# EAGLE design 1U_LFO (EAGLE 8.1.1)
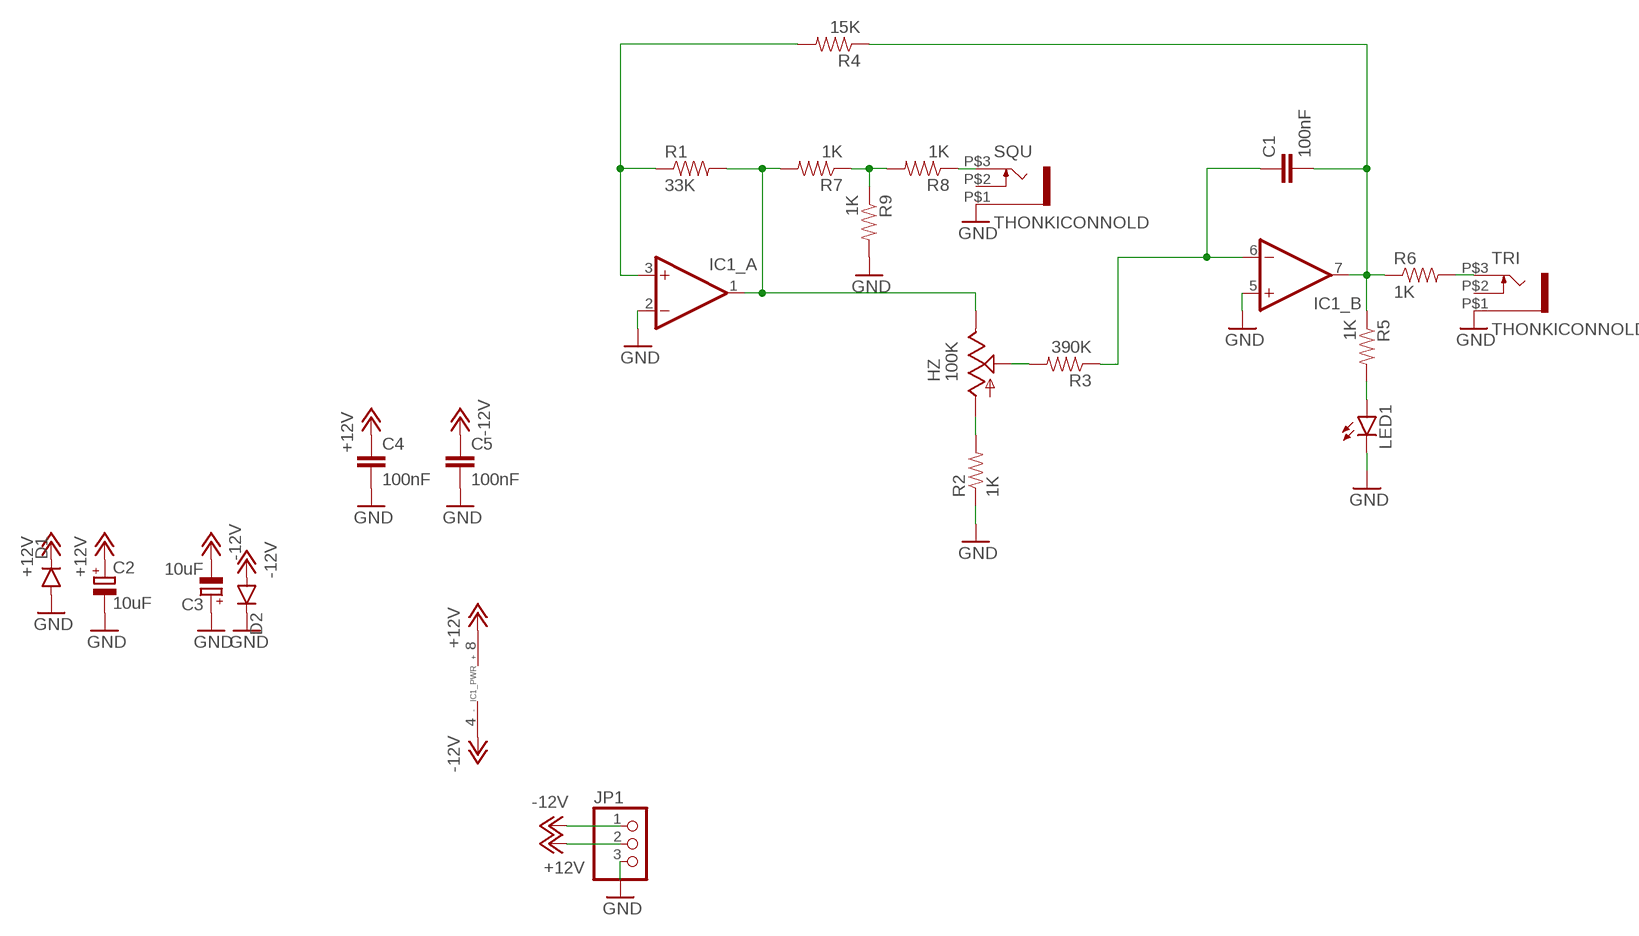
[diagram p0: schematic, sheet 1]

## Parts
C1  100nF  CAP0603-CAP  [0603-CAP]
C2  10uF  CAPACITOR_POL-CASE_B  [CASE_B]
C3  10uF  CAPACITOR_POL-CASE_B  [CASE_B]
C4  100nF  CAP0603-CAP  [0603-CAP]
C5  100nF  CAP0603-CAP  [0603-CAP]
D1  DIODESOD123  [SOD-123]
D2  DIODESOD123  [SOD-123]
HZ  100K  9MM_SNAP-IN_POT_  [9MM_SNAP-IN_POT]
IC1  DUALSMD  [SO08]
JP1  EUROPWR_TILE-TILE  [1X03_EUROPWR_TILE]
LED1  LED3MM  [LED3MM]
R1  33K  RESISTOR0603-RES  [0603-RES]
R2  1K  RESISTOR0603-RES  [0603-RES]
R3  390K  RESISTOR0603-RES  [0603-RES]
R4  15K  RESISTOR0603-RES  [0603-RES]
R5  1K  RESISTOR0603-RES  [0603-RES]
R6  1K  RESISTOR0603-RES  [0603-RES]
R7  1K  RESISTOR0603-RES  [0603-RES]
R8  1K  RESISTOR0603-RES  [0603-RES]
R9  1K  RESISTOR0603-RES  [0603-RES]
SQU  THONKICONNOLD  [THONKICONN]
TRI  THONKICONNOLD  [THONKICONN]

## Nets
+12V: C2.+ C4.1 D1.C IC1.8(_PWR:V+) JP1.2
-12V: C3.- C5.1 D2.A IC1.4(_PWR:V-) JP1.1
GND: C2.- C3.+ C4.2 C5.2 D1.A D2.C IC1.2(_A:-IN) IC1.5(_B:+IN) JP1.3 LED1.K(C) R2.1 R9.2 SQU.P$1 TRI.P$1
N$1: HZ.3(E) IC1.1(_A:OUT) R1.2 R7.2
N$2: HZ.1(A) R2.2
N$3: HZ.2(S) R3.2
N$4: C1.1 IC1.6(_B:-IN) R3.1
N$5: IC1.3(_A:+IN) R1.1 R4.2
N$6: C1.2 IC1.7(_B:OUT) R4.1 R5.1 R6.1
N$7: LED1.A R5.2
N$8: R6.2 TRI.P$3
N$9: R8.1 SQU.P$3
N$10: R7.1 R8.2 R9.1
Unconnected: SQU.P$2 TRI.P$2

## Library data of the parts
C1 C4 C5 = SparkFun-Passives:CAP: Capacitor Standard 0603 ceramic capacitor, and 0.1" leaded capacitor.
C2 C3 = dp_devices:CAPACITOR_POL: Polarized capacitor in various packages
D1 D2 = SparkFun-DiscreteSemi:DIODE: Diode These are standard reverse protection diodes and small signal diodes. SMA package can handle up to about 1A. SOD-323 can handle about 200mA. What the SOD-323 package when ordering, there are some mfgs out there that are 5-pin packages.
HZ = MusicThingModular:9MM_SNAP-IN_POT: 9mm vertical snap-in pot, Alpha / Panasonic style
IC1 = integrated circuits:DUAL: OP AMP
JP1 = tsyklon-labs:EUROPWR_TILE: PIN HEADER
LED1 = SparkFun-LED:LED: LEDs Standard schematic elements and footprints for 5mm, 3mm, 1206, and 0603 sized LEDs. 5mm - Spark Fun Electronics SKU : COM-00529 (and others)
R1-R9 = SparkFun-Passives:RESISTOR: Resistor Basic schematic elements and footprints for 0603, 1206, and PTH resistors.
SQU TRI = MusicThingModular:THONKICONN: 3.5mm socket for Eurorack modular synths

## Board
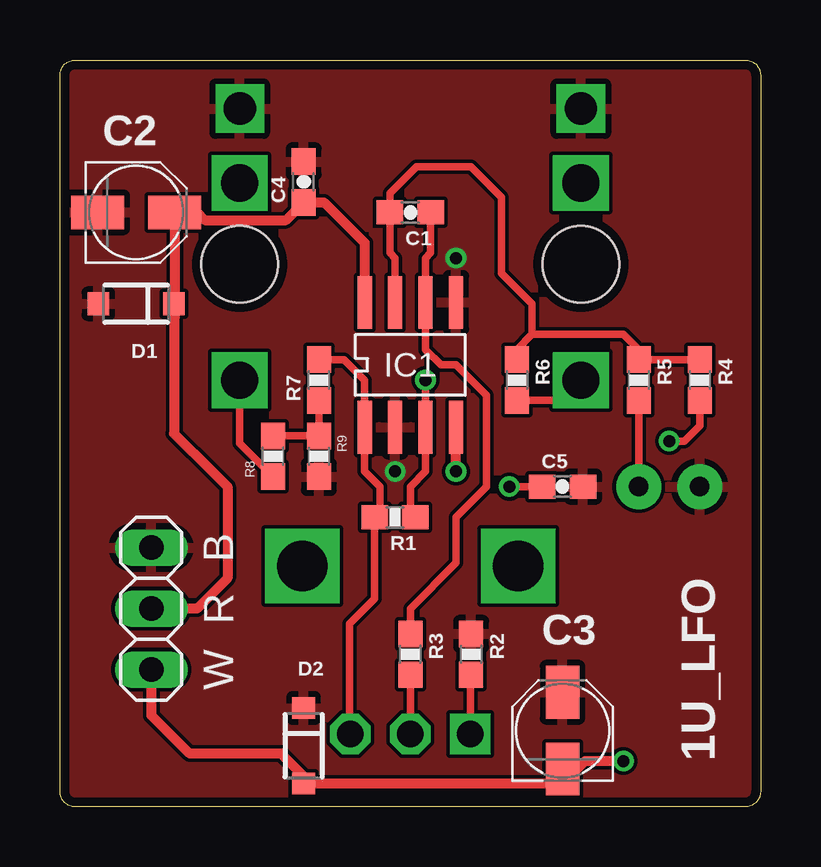
[diagram p1: board, top side]
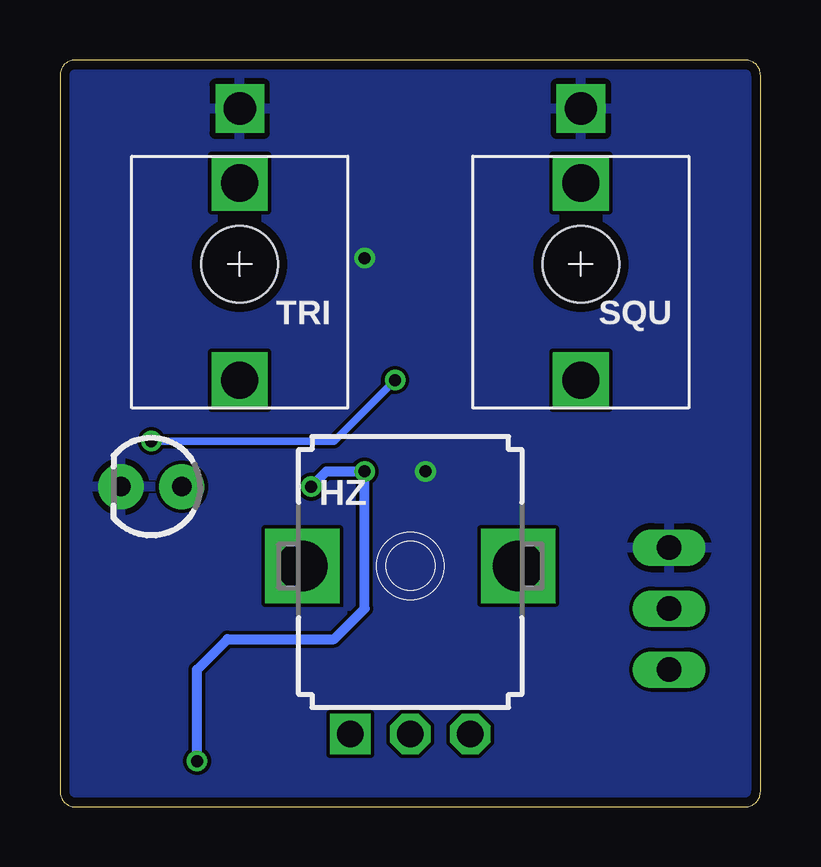
[diagram p2: board, bottom side, seen from below]

Size 29.21 x 31.11 mm. Coordinates in mm from the lower left corner, seen from the top.
Outline: 28.57,0 0.64,0 arc-90 0,0.64 0,30.48 arc-90 0.64,31.11 28.57,31.11 arc-90 29.21,30.48 29.21,0.64 arc-90 28.57,0
Copper layers (1*16): Top 0.0356mm / dielectric 1.5011mm / Bottom 0.0356mm
Design rules "PCBs_io": minimum track width 6mil, minimum drill 13mil, track to track 6mil, track to pad 6mil, pad to pad 6mil, via to via 6mil, smd to smd 6mil, copper to edge 15mil, drill to drill 6mil, minimum pad ring 7mil, minimum via ring 7mil, stop-mask expansion 3mil, vias tented up to drill 0mil, thermal gap 10mil
Holes 3.2 mm at 7.49,22.61 21.72,22.61

### Footprints (pad centres in the part's own frame; a part is rotated, then mirrored left to right if it is on the bottom)
0603-CAP = smd 1.1 x 1: 1 -0.85,0; 2 0.85,0
CASE_B = smd 2.2 x 1.4: + 1.6,0; - -1.6,0
SOD-123 = smd 0.9 x 0.95: A 1.575,0; C -1.575,0
9MM_SNAP-IN_POT = drill 1.1 pad 1.676 square: 1 -2.5,-7 | drill 1.1 pad 1.676 octagon: 2 0,-7; 3 2.5,-7 | drill 2.1 pad 2.8 square: M1 4.5,0; M2 -4.5,0
SO08 = smd 0.6 x 2.2: 1 -1.905,-2.6; 2 -0.635,-2.6; 3 0.635,-2.6; 4 1.905,-2.6; 5 1.905,2.6; 6 0.635,2.6; 7 -0.635,2.6; 8 -1.905,2.6
1X03_EUROPWR_TILE = drill 1.016 long: 1 -2.54,0; 2 0,0; 3 2.54,0
LED3MM = drill 0.813 pad 1.88: A -1.27,0; K 1.27,0
0603-RES = smd 1.1 x 1: 1 -0.85,0; 2 0.85,0
THONKICONN = drill 1.35 square: P$1 0,-6.48 | drill 1.55 square: P$2 0,-3.38; P$3 0,4.84

### Placement (x,y rotation side)
C1  14.61,24.76 180 top
C2  3.17,24.76 0 top
C3  20.95,3.17 90 top
C4  10.16,26.04 90 top
C5  20.95,13.34 0 top
D1  3.17,20.95 180 top
D2  10.16,2.54 270 top
HZ  14.61,10.03 0 bottom
IC1  14.61,18.41 0 top
JP1  3.81,8.26 90 top
LED1  25.4,13.34 180 bottom
R1  13.97,12.06 180 top
R2  17.14,6.35 270 top
R3  14.61,6.35 270 top
R4  26.67,17.78 270 top
R5  24.13,17.78 270 top
R6  19.05,17.78 270 top
R7  10.79,17.78 90 top
R8  8.89,14.61 90 top
R9  10.79,14.61 270 top
SQU  7.49,22.61 180 bottom
TRI  21.72,22.61 180 bottom

### Tracks (layer width: path | path; a pad name or v marks a point on that pad's centre or on a via)
+12V
  Top 0.305: 4.78,20.34 D1.C
  Top 0.406: 4.78,20.34 C2.+ 5.71,24.76 6.03,24.45 9.42,24.45 C4.1 11.01,25.18 12.7,23.49 IC1.8 | D1.C 4.75,15.54 6.35,13.97 6.99,13.34 6.99,9.53 5.71,8.26 JP1.2
-12V  (via drill 0.5)
  Top 0.305: 20.65,0.97 20.95,1.27 20.93,0.94 C3.- 21.26,1.57 | C5.1 v18.73,13.34
  Top 0.406: v16.51,13.97 IC1.4 | 20.65,0.97 D2.A 10.16,1.27 9.22,2.21 5.41,2.21 3.81,3.81 JP1.1 | v23.49,1.91 21.89,1.91 20.93,0.94
  Bottom 0.406: v18.73,13.34 18.1,13.97 v16.51,13.97 16.51,8.26 17.78,6.99 22.22,6.99 23.49,5.71 v23.49,1.91
GND  (via drill 0.5)
  other vias: 16.51,22.86 13.97,13.97
  pour Top: -5.71,45.09 33.66,45.09 33.66,-1.91 -5.71,-1.91
  pour Bottom: -3.17,47.62 36.2,47.62 36.2,-4.45 -3.17,-4.45
N$1
  Top 0.305: HZ.3 12.06,3.07 12.06,7.62 13.12,8.68 R1.2 13.34,12.28 13.34,13.34 12.7,13.97 IC1.1 12.7,17.78 11.85,18.63 R7.2
N$2
  Top 0.305: HZ.1 17.1,5.46 R2.2
N$3
  Top 0.305: HZ.2 R3.2
N$4
  Top 0.305: C1.1 15.46,23.07 15.24,22.86 IC1.6 15.24,19.05 15.88,18.41 16.51,18.41 17.78,17.14 17.78,13.34 16.51,12.06 16.51,10.16 14.61,8.26 R3.1
N$5  (via drill 0.5)
  Top 0.305: R1.1 14.61,12.28 14.61,13.34 15.24,13.97 IC1.3 v15.24,17.78 | R4.2 26.67,15.88 26.04,15.24 v25.4,15.24
  Bottom 0.305: v25.4,15.24 17.78,15.24 v15.24,17.78
N$6
  Top 0.305: IC1.7 13.97,22.86 13.76,23.07 C1.2 13.76,25.57 14.86,26.67 17.14,26.67 18.41,25.4 18.41,22.22 19.68,20.95 19.68,19.68 | 19.68,19.68 23.49,19.68 24.13,19.05 R5.1 R4.1 | R6.1 19.05,19.05 19.68,19.68
N$7
  Top 0.305: R5.2 LED1.A
N$8
  Top 0.305: R6.2 20.88,16.93 TRI.P$3
N$9
  Top 0.305: SQU.P$3 7.49,15.15 R8.1
N$10
  Top 0.305: R7.1 R9.1 R8.2

### Text on the board
tPlace: 1U_LFO